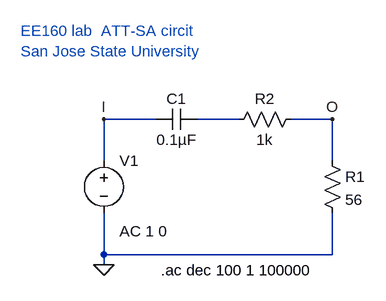
[diagram p0: schematic EE160_ATT_SA_circuit.asc]
EE160_ATT_SA_circuit.asc, the LTspice schematic file:
Version 4
SHEET 1 880 680
WIRE 0 112 -80 112
WIRE 128 112 64 112
WIRE 272 112 208 112
WIRE -80 176 -80 112
WIRE 272 176 272 112
WIRE -80 320 -80 256
WIRE 272 320 272 256
WIRE 272 320 -80 320
WIRE -80 336 -80 320
FLAG -80 336 0
FLAG 272 112 O
FLAG -80 112 I
SYMBOL voltage -80 160 R0
WINDOW 123 24 124 Left 2
WINDOW 39 0 0 Left 2
SYMATTR Value2 AC 1 0
SYMATTR InstName V1
SYMATTR Value ""
SYMBOL cap 0 128 R270
WINDOW 0 32 32 VTop 2
WINDOW 3 0 32 VBottom 2
SYMATTR InstName C1
SYMATTR Value 0.1µF
SYMBOL res 256 160 R0
SYMATTR InstName R1
SYMATTR Value 56
SYMBOL res 112 128 R270
WINDOW 0 32 56 VTop 2
WINDOW 3 0 56 VBottom 2
SYMATTR InstName R2
SYMATTR Value 1k
TEXT 8 344 Left 2 !.ac dec 100 1 100000
TEXT -208 -24 Left 2 ;EE160 lab  ATT-SA circit\nSan Jose State University

The netlist it stands for:
* EE160_ATT_SA_circuit.asc
V1 I 0 AC 1 0
C1 I N001 0.1µF
R1 O 0 56
R2 N001 O 1k
.ac dec 100 1 100000
* EE160 lab  ATT-SA circit
* San Jose State University
.backanno
.end